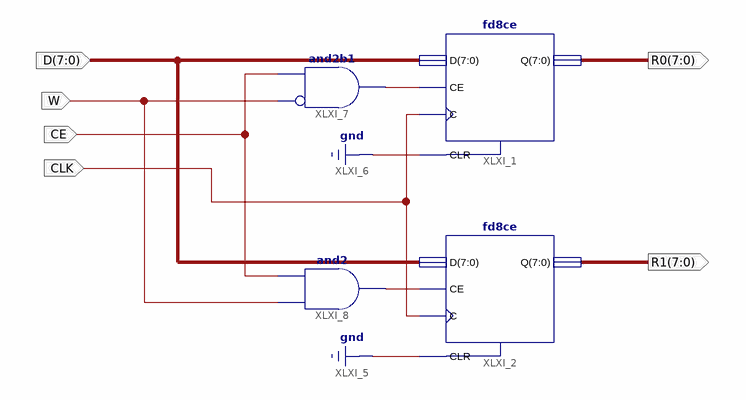
[diagram p0: schematic sheet 1]
// Xilinx ISE schematic regs.sch (spartan6) as structural Verilog: 4 symbols, 6 ports
module regs (
  input  [7:0] D,
  input  CLK,
  input  W,
  input  CE,
  output [7:0] R1,
  output [7:0] R0
);

  wire XLXN_4, XLXN_5;

  fd8ce XLXI_1 (.C(CLK), .CE(XLXN_4), .CLR(1'b0), .D(D), .Q(R0));
  fd8ce XLXI_2 (.C(CLK), .CE(XLXN_5), .CLR(1'b0), .D(D), .Q(R1));
  and XLXI_7 (XLXN_4, ~W, CE);  // and2b1
  and XLXI_8 (XLXN_5, W, CE);
endmodule
